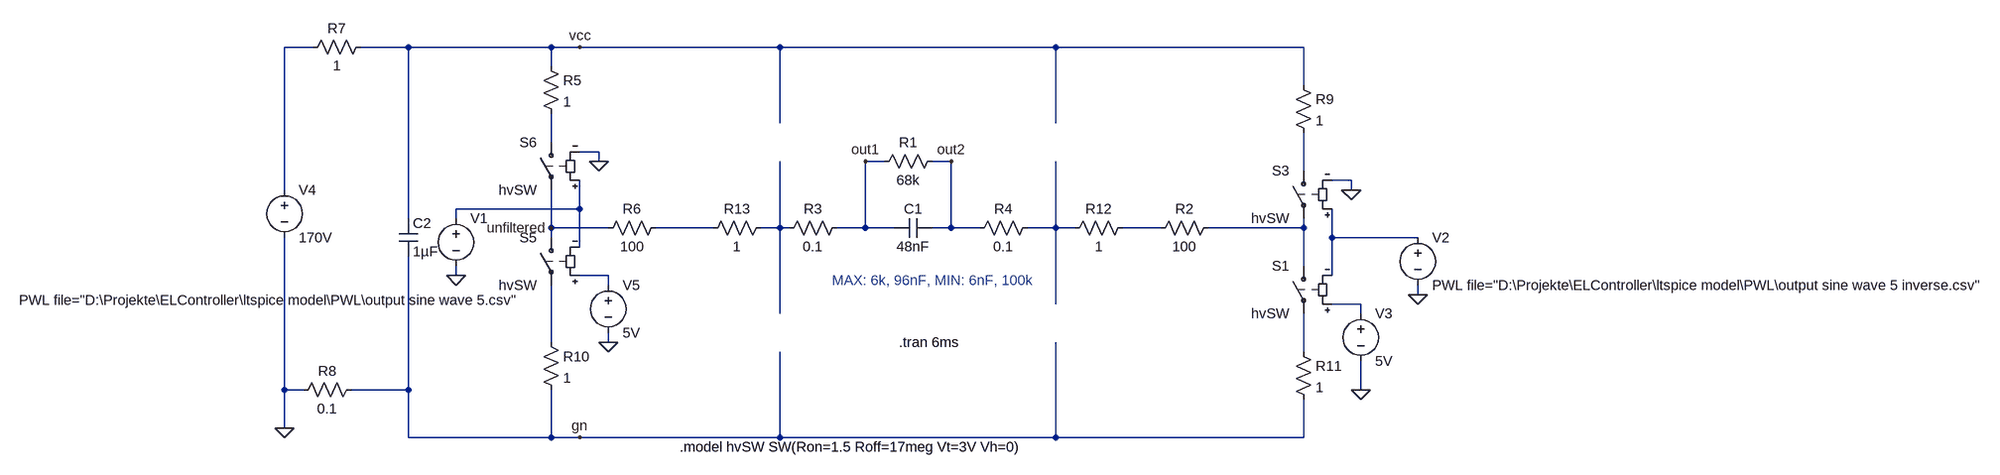
[diagram p0: schematic Filter Test R4 new resistor.asc]
Filter Test R4 new resistor.asc, the LTspice schematic file:
Version 4
SHEET 1 2672 680
WIRE -752 -224 -800 -224
WIRE -592 -224 -672 -224
WIRE -352 -224 -592 -224
WIRE -304 -224 -352 -224
WIRE 32 -224 -304 -224
WIRE 496 -224 32 -224
WIRE 912 -224 496 -224
WIRE -352 -192 -352 -224
WIRE 912 -160 912 -224
WIRE 32 -96 32 -224
WIRE 496 -96 496 -224
WIRE -352 -64 -352 -112
WIRE -272 -48 -304 -48
WIRE -272 -32 -272 -48
WIRE 208 -32 176 -32
WIRE 320 -32 288 -32
WIRE 912 -16 912 -80
WIRE 992 0 960 0
WIRE -800 16 -800 -224
WIRE 992 16 992 0
WIRE -304 48 -304 0
WIRE -304 48 -512 48
WIRE -592 64 -592 -224
WIRE -512 64 -512 48
WIRE -352 80 -352 16
WIRE -256 80 -352 80
WIRE -80 80 -176 80
WIRE 32 80 32 -32
WIRE 32 80 0 80
WIRE 48 80 32 80
WIRE 176 80 176 -32
WIRE 176 80 128 80
WIRE 224 80 176 80
WIRE 320 80 320 -32
WIRE 320 80 288 80
WIRE 368 80 320 80
WIRE 496 80 496 -32
WIRE 496 80 448 80
WIRE 528 80 496 80
WIRE 672 80 608 80
WIRE 912 80 912 64
WIRE 912 80 752 80
WIRE -352 96 -352 80
WIRE 960 96 960 48
WIRE 1104 96 960 96
WIRE -304 112 -304 48
WIRE 912 144 912 80
WIRE -512 160 -512 144
WIRE -256 160 -304 160
WIRE 960 160 960 96
WIRE -256 176 -256 160
WIRE 1104 192 1104 176
WIRE 496 208 496 80
WIRE 1008 208 960 208
WIRE 32 224 32 80
WIRE 1008 224 1008 208
WIRE -352 272 -352 176
WIRE -256 272 -256 256
WIRE 912 288 912 224
WIRE -800 352 -800 96
WIRE -768 352 -800 352
WIRE -592 352 -592 128
WIRE -592 352 -688 352
WIRE 1008 352 1008 304
WIRE -800 416 -800 352
WIRE -592 432 -592 352
WIRE -352 432 -352 352
WIRE -352 432 -592 432
WIRE -304 432 -352 432
WIRE 32 432 32 288
WIRE 32 432 -304 432
WIRE 496 432 496 272
WIRE 496 432 32 432
WIRE 912 432 912 368
WIRE 912 432 496 432
FLAG 176 -32 out1
FLAG 320 -32 out2
FLAG 1008 352 0
FLAG 992 16 0
FLAG 1104 192 0
FLAG -800 416 0
FLAG -256 272 0
FLAG -272 -32 0
FLAG -512 160 0
FLAG -304 -224 vcc
FLAG -304 432 gn
FLAG -352 80 unfiltered
SYMBOL voltage -512 48 R0
WINDOW 123 0 0 Left 0
WINDOW 39 0 0 Left 0
WINDOW 3 -734 153 Left 2
SYMATTR Value PWL file="D:\Projekte\ELController\ltspice model\PWL\output sine wave 5.csv"
SYMATTR InstName V1
SYMBOL cap 288 64 R90
WINDOW 0 0 32 VBottom 2
WINDOW 3 32 32 VTop 2
SYMATTR InstName C1
SYMATTR Value 48nF
SYMBOL voltage 1104 80 R0
WINDOW 123 0 0 Left 0
WINDOW 39 0 0 Left 0
SYMATTR InstName V2
SYMATTR Value PWL file="D:\Projekte\ELController\ltspice model\PWL\output sine wave 5 inverse.csv"
SYMBOL res 304 -48 R90
WINDOW 0 0 56 VBottom 2
WINDOW 3 32 56 VTop 2
SYMATTR InstName R1
SYMATTR Value 68k
SYMBOL sw 912 128 M0
SYMATTR InstName S1
SYMATTR Value hvSW
SYMBOL sw 912 -32 M0
SYMATTR InstName S3
SYMATTR Value hvSW
SYMBOL voltage 1008 208 R0
WINDOW 123 0 0 Left 0
WINDOW 39 0 0 Left 0
SYMATTR InstName V3
SYMATTR Value 5V
SYMBOL sw -352 80 M0
SYMATTR InstName S5
SYMATTR Value hvSW
SYMBOL sw -352 -80 M0
SYMATTR InstName S6
SYMATTR Value hvSW
SYMBOL voltage -256 160 R0
WINDOW 123 0 0 Left 0
WINDOW 39 0 0 Left 0
SYMATTR InstName V5
SYMATTR Value 5V
SYMBOL res -160 64 R90
WINDOW 0 0 56 VBottom 2
WINDOW 3 32 56 VTop 2
SYMATTR InstName R6
SYMATTR Value 100
SYMBOL cap -608 64 R0
SYMATTR InstName C2
SYMATTR Value 1µF
SYMBOL res -656 -240 R90
WINDOW 0 0 56 VBottom 2
WINDOW 3 32 56 VTop 2
SYMATTR InstName R7
SYMATTR Value 1
SYMBOL res -672 336 R90
WINDOW 0 0 56 VBottom 2
WINDOW 3 32 56 VTop 2
SYMATTR InstName R8
SYMATTR Value 0.1
SYMBOL res 768 64 R90
WINDOW 0 0 56 VBottom 2
WINDOW 3 32 56 VTop 2
SYMATTR InstName R2
SYMATTR Value 100
SYMBOL voltage -800 0 R0
WINDOW 123 0 0 Left 0
WINDOW 39 0 0 Left 0
SYMATTR InstName V4
SYMATTR Value 170V
SYMBOL res 144 64 R90
WINDOW 0 0 56 VBottom 2
WINDOW 3 32 56 VTop 2
SYMATTR InstName R3
SYMATTR Value 0.1
SYMBOL res 464 64 R90
WINDOW 0 0 56 VBottom 2
WINDOW 3 32 56 VTop 2
SYMATTR InstName R4
SYMATTR Value 0.1
SYMBOL res -368 -208 R0
SYMATTR InstName R5
SYMATTR Value 1
SYMBOL res 896 -176 R0
SYMATTR InstName R9
SYMATTR Value 1
SYMBOL res -368 256 R0
SYMATTR InstName R10
SYMATTR Value 1
SYMBOL res 896 272 R0
SYMATTR InstName R11
SYMATTR Value 1
SYMBOL res 624 64 R90
WINDOW 0 0 56 VBottom 2
WINDOW 3 32 56 VTop 2
SYMATTR InstName R12
SYMATTR Value 1
SYMBOL res 16 64 R90
WINDOW 0 0 56 VBottom 2
WINDOW 3 32 56 VTop 2
SYMATTR InstName R13
SYMATTR Value 1
TEXT 232 272 Left 2 !.tran 6ms
TEXT -136 448 Left 2 !.model hvSW SW(Ron=1.5 Roff=17meg Vt=3V Vh=0)
TEXT 120 168 Left 2 ;MAX: 6k, 96nF, MIN: 6nF, 100k

The netlist it stands for:
* Filter Test R4 new resistor.asc
V1 N004 0 PWL file="D:\Projekte\ELController\ltspice model\PWL\output sine wave 5.csv"
C1 out2 out1 48nF
V2 N010 0 PWL file="D:\Projekte\ELController\ltspice model\PWL\output sine wave 5 inverse.csv"
R1 out2 out1 68k
S1 N009 N014 N012 N010 hvSW
S3 N003 N009 N010 0 hvSW
V3 N012 0 5V
S5 unfiltered N013 N011 N004 hvSW
S6 N002 unfiltered N004 0 hvSW
V5 N011 0 5V
R6 N005 unfiltered 100
C2 vcc gn 1µF
R7 vcc N001 1
R8 gn 0 0.1
R2 N009 N008 100
V4 N001 0 170V
R3 out1 N006 0.1
R4 N007 out2 0.1
R5 vcc N002 1
R9 vcc N003 1
R10 N013 gn 1
R11 N014 gn 1
R12 N008 N007 1
R13 N006 N005 1
.tran 6ms
.model hvSW SW(Ron=1.5 Roff=17meg Vt=3V Vh=0)
* MAX: 6k, 96nF, MIN: 6nF, 100k
.backanno
.end